# Altium schematic sheet TSK51.SchDoc
size B; Organization: Altium Limited; Address1: L3, 12a Rodborough Rd; Address2: Frenchs Forest; Address3: NSW; Address4: Australia 2086; DocumentNumber: 2; SheetNumber: 2; SheetTotal: 3
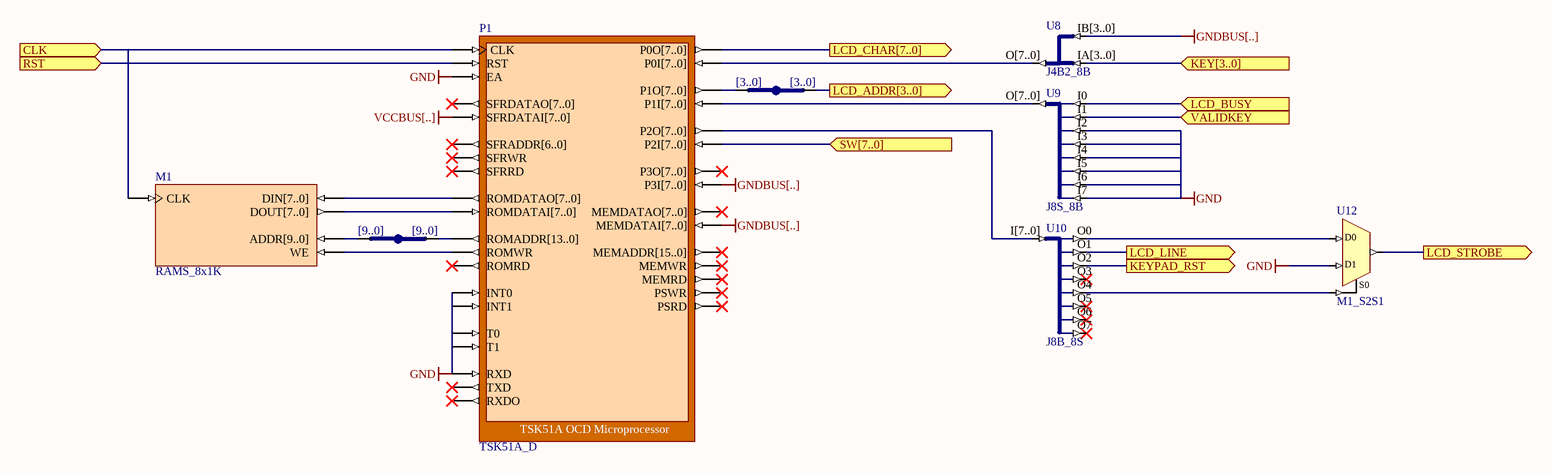
[diagram p0: TSK51.SchDoc]

## Parts
JB_S1  IndexA: [3..0]  (hidden comment: JB)
JB_S2  IndexA: [9..0]  (hidden comment: JB)
M1  RAMS_8x1K
P1  TSK51A_D
U8  J4B2_8B
U9  J8S_8B
U10  J8B_8S
U12  M1_S2S1

## Ports
CLK (in), KEY[3..0] (in), KEYPAD_RST (out), LCD_ADDR[3..0] (out), LCD_BUSY (in), LCD_CHAR[7..0] (out), LCD_LINE (out), LCD_STROBE (out), RST (in), SW[7..0] (in), VALIDKEY (in)

## Nets
GND: P1.EA P1.INT0 P1.INT1 P1.RXD P1.T0 P1.T1 U9.I2 U9.I3 U9.I4 U9.I5 U9.I6 U9.I7 U12.D1
GNDBUS[..]: P1.MEMDATAI[7..0] P1.P3I[7..0] U8.IB[3..0]
VCCBUS[..]: P1.SFRDATAI[7..0]
CLK: M1.CLK P1.CLK ; port CLK
KEY[3..0]: U8.IA[3..0] ; port KEY[3..0]
KEYPAD_RST: U10.O2 ; port KEYPAD_RST
LCD_ADDR[3..0]: JB_S1.B[0..0] ; port LCD_ADDR[3..0]
LCD_BUSY: U9.I0 ; port LCD_BUSY
LCD_CHAR[7..0]: P1.P0O[7..0] ; port LCD_CHAR[7..0]
LCD_LINE: U10.O1 ; port LCD_LINE
LCD_STROBE: U12.O ; port LCD_STROBE
RST: P1.RST ; port RST
SW[7..0]: P1.P2I[7..0] ; port SW[7..0]
VALIDKEY: U9.I1 ; port VALIDKEY
NetJB_S1_A[0..0]: JB_S1.A[0..0](IA[0..0]) P1.P1O[7..0]
NetJB_S2_A[0..0]: JB_S2.A[0..0](IA[0..0]) M1.ADDR[9..0]
NetJB_S2_B[0..0]: JB_S2.B[0..0] P1.ROMADDR[13..0]
NetM1_DIN[7..0]: M1.DIN[7..0] P1.ROMDATAO[7..0]
NetM1_DOUT[7..0]: M1.DOUT[7..0] P1.ROMDATAI[7..0]
NetM1_WE: M1.WE P1.ROMWR
NetP1_P0I[7..0]: P1.P0I[7..0] U8.O[7..0]
NetP1_P1I[7..0]: P1.P1I[7..0] U9.O[7..0]
NetP1_P2O[7..0]: P1.P2O[7..0] U10.I[7..0]
NetU10_O0: U10.O0 U12.D0
NetU10_O4: U10.O4 U12.S0

Not connected (* = marked no-connect by the designer): P1 MEMADDR[15..0]* MEMDATAO[7..0]* MEMRD* MEMWR* P3O[7..0]* PSRD* PSWR* ROMRD* RXDO* SFRADDR[6..0]* SFRDATAO[7..0]* SFRRD* SFRWR* TXD*; U10 O3* O5* O6* O7*

## Notes on the sheet
- Title
- Size:
- Date:
- B
- Number:
- Time:
- Revision:
- Sheet
- of
- File:

## Library data of the parts
JB_S1 JB_S2 = JB: System Joiner; Class I: Bus Joiner; ArchiveName: GENERIC; Published: 18-Sep-2003; Publisher: Altium Limited
  JB_S1: IndexB: [3..0]
  JB_S2: IndexB: [9..0]
M1 = RAMS_8x1K: Single Port Random Access Memory; Memory_Depth: 1024; Memory_Type: RAM_SinglePortBlock; Memory_Width: 8; Memory_ClockEdge: Rising; Nexus_Core: Memory_Program; Published: 13/01/2004; Publisher: Altium Hobart Technology Center
P1 = TSK51A_D: TSK51A OCD Microprocessor; NEXUS_CORE: Processor_OCDS; NEXUS_JTAG_DEVICE: True; NEXUS_JTAG_ORDER: 0; ChildModel1: RAM256x8_TSK51D; ChildCore1: M1; Published: 23/10/2003; Publisher: Altium Hobart Technology Centre; Core Revision: 1.00.00
U8 = J4B2_8B: 2 x 4-Bit input bus to 1 x 8-bit output bus; ArchiveName: GENERIC; Published: 18-Dec-2003; Publisher: Altium Limited; Core Revision: 1.00.00
U9 = J8S_8B: 8 Single pin inputs to single 8-Bit output bus; ArchiveName: GENERIC; Published: 18-Dec-2003; Publisher: Altium Limited; Core Revision: 1.00.00
U10 = J8B_8S: 8-Bit input bus to 8 single pin outputs; ArchiveName: GENERIC; Published: 18-Dec-2003; Publisher: Altium Limited; Core Revision: 1.00.00
U12 = M1_S2S1: 2x1-Single Wire to 1x1-Single Wire Multiplexer; Xilinx Equivalent: M2_1; ArchiveName: GENERIC; VHDLIB_SIM: GENERIC_LIB; Published: 28-Jan-2004; Publisher: Altium Limited; Core Revision: 1.00.00